# EAGLE design Stereo_Audio_Codec_Breakout_WM8960 (EAGLE 9.6.2)
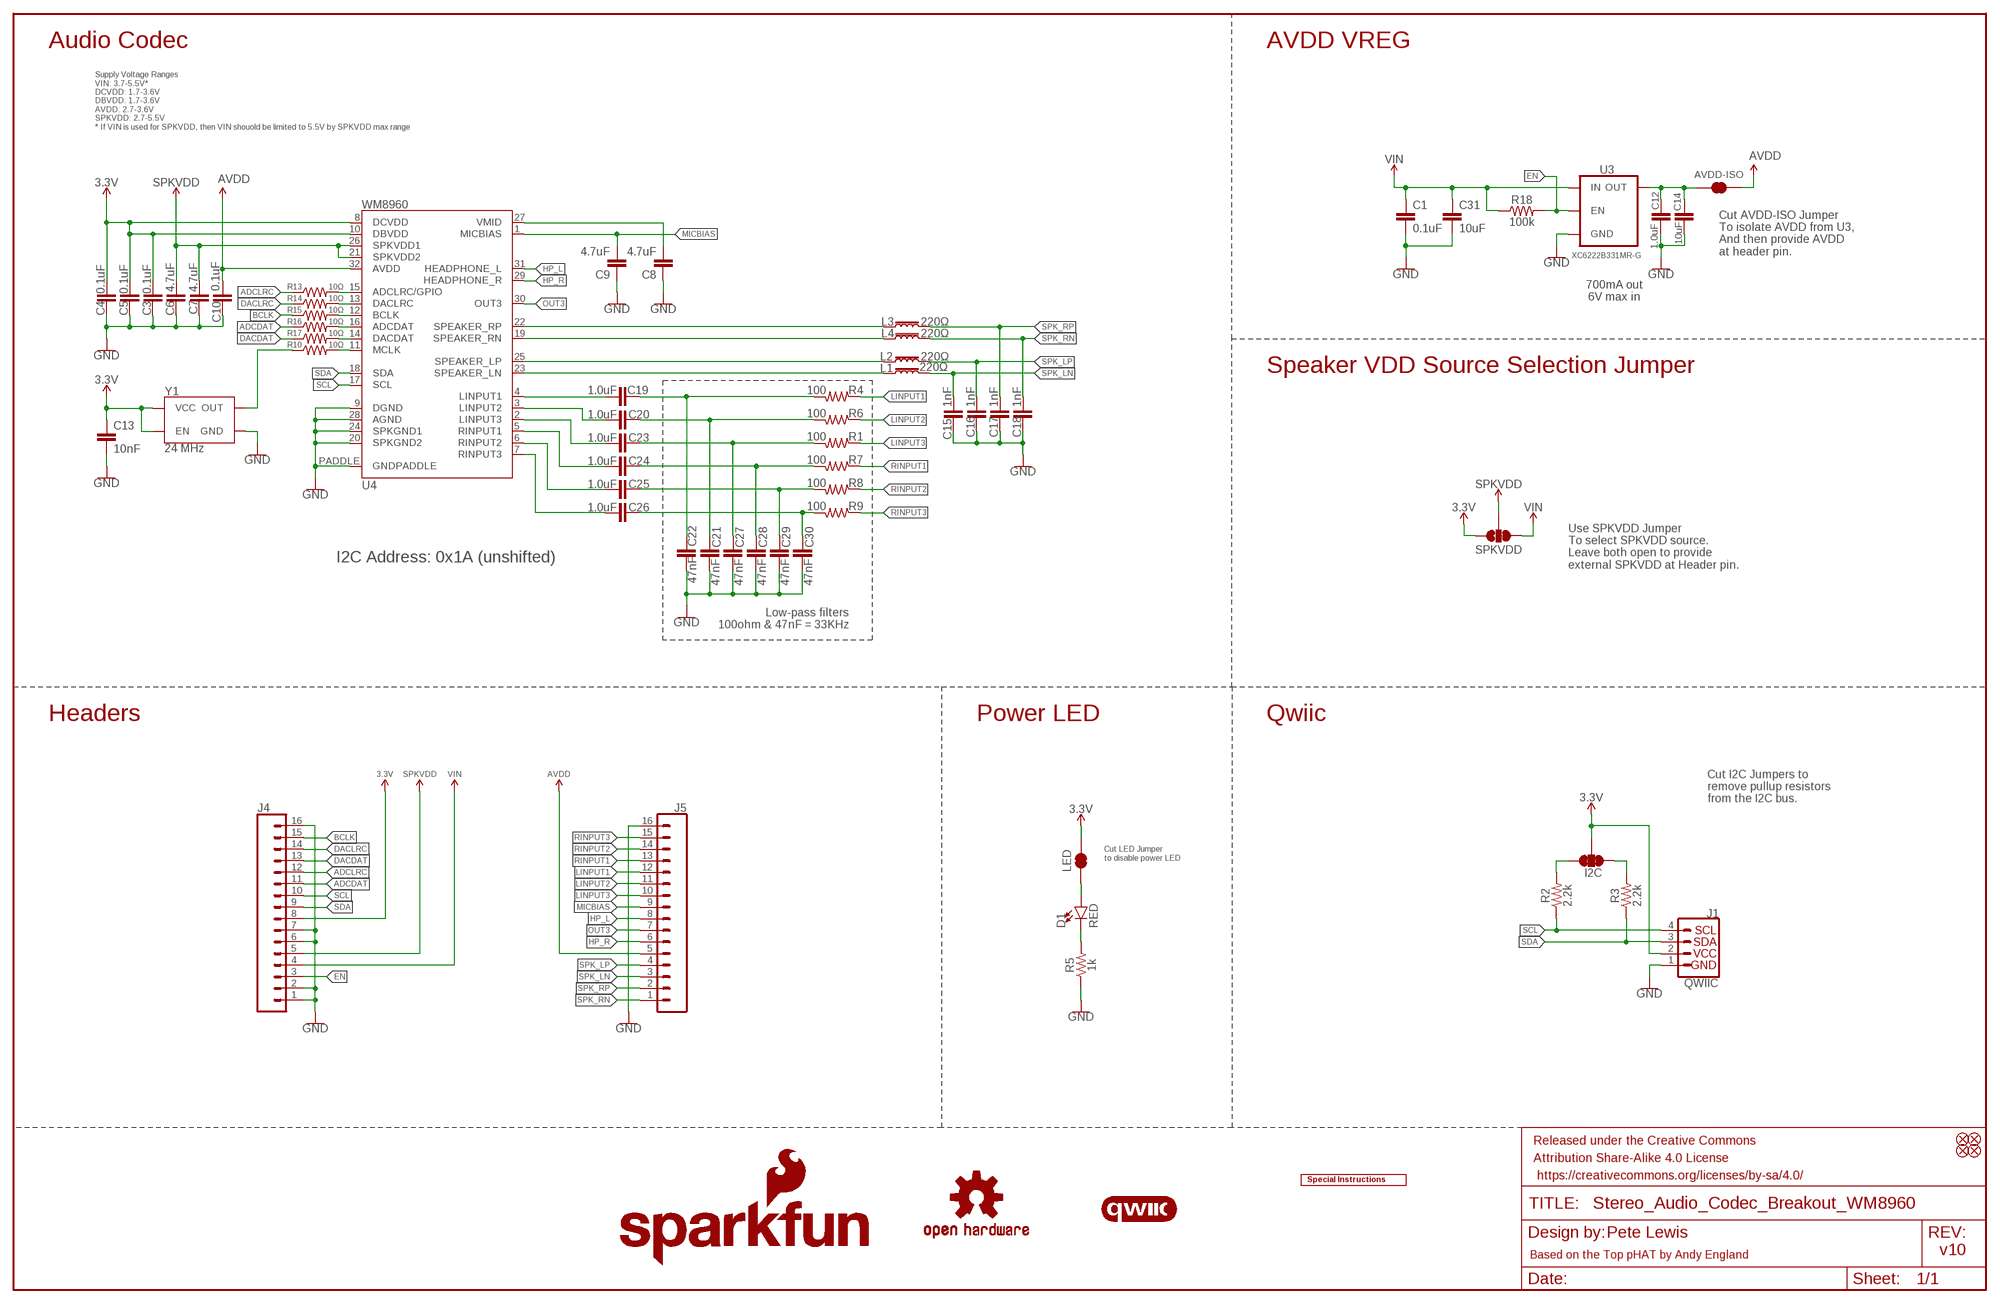
[diagram p0: schematic, sheet 1]

## Parts
AVDD-ISO  JUMPER-SMT_2_NC_TRACE_SILK  [SMT-JUMPER_2_NC_TRACE_SILK]
C1  0.1uF  0.1UF-0402T-16V-10%  [0402-TIGHT]
C3  0.1uF  0.1UF-0402T-16V-10%  [0402-TIGHT]
C4  0.1uF  0.1UF-0402T-16V-10%  [0402-TIGHT]
C5  0.1uF  0.1UF-0402T-16V-10%  [0402-TIGHT]
C6  4.7uF  4.7UF-0603-6.3V-(10%)  [0603]
C7  4.7uF  4.7UF-0603-6.3V-(10%)  [0603]
C8  4.7uF  4.7UF-0402_TIGHT-6.3V-20%-X5R  [0402-TIGHT]
C9  4.7uF  4.7UF-0402_TIGHT-6.3V-20%-X5R  [0402-TIGHT]
C10  0.1uF  0.1UF-0402T-16V-10%  [0402-TIGHT]
C12  1.0uF  1.0UF-0402T-16V-10%  [0402-TIGHT]
C13  10nF  10NF-0402T-25V-10%  [0402-TIGHT]
C14  10uF  10UF-0402T-6.3V-20%  [0402-TIGHT]
C15  1nF  1.0NF/1000PF-0402-25V-10%-X7R  [0402]
C16  1nF  1.0NF/1000PF-0402-25V-10%-X7R  [0402]
C17  1nF  1.0NF/1000PF-0402-25V-10%-X7R  [0402]
C18  1nF  1.0NF/1000PF-0402-25V-10%-X7R  [0402]
C19  1.0uF  1.0UF-0402T-16V-10%  [0402-TIGHT]
C20  1.0uF  1.0UF-0402T-16V-10%  [0402-TIGHT]
C21  47nF  47NF-0402_TIGHT-25V-10%-X7R  [0402-TIGHT]
C22  47nF  47NF-0402_TIGHT-25V-10%-X7R  [0402-TIGHT]
C23  1.0uF  1.0UF-0402T-16V-10%  [0402-TIGHT]
C24  1.0uF  1.0UF-0402T-16V-10%  [0402-TIGHT]
C25  1.0uF  1.0UF-0402T-16V-10%  [0402-TIGHT]
C26  1.0uF  1.0UF-0402T-16V-10%  [0402-TIGHT]
C27  47nF  47NF-0402_TIGHT-25V-10%-X7R  [0402-TIGHT]
C28  47nF  47NF-0402_TIGHT-25V-10%-X7R  [0402-TIGHT]
C29  47nF  47NF-0402_TIGHT-25V-10%-X7R  [0402-TIGHT]
C30  47nF  47NF-0402_TIGHT-25V-10%-X7R  [0402-TIGHT]
C31  10uF  10UF-0402T-6.3V-20%  [0402-TIGHT]
D1  RED  LED-RED0603  [LED-0603]
FD1  FIDUCIALUFIDUCIAL  [FIDUCIAL-MICRO]
FD2  FIDUCIALUFIDUCIAL  [FIDUCIAL-MICRO]
FD3  FIDUCIALUFIDUCIAL  [FIDUCIAL-MICRO]
FD4  FIDUCIALUFIDUCIAL  [FIDUCIAL-MICRO]
FRAME1  FRAME-LEDGER  [CREATIVE_COMMONS]
I2C  JUMPER-SMT_3_2-NC_TRACE_SILK  [SMT-JUMPER_3_2-NC_TRACE_SILK]
J1  QWIIC  QWIIC_CONNECTORJS-1MM  [JST04_1MM_RA]
J4  CONN_161X16_NO_SILK  [1X16_NO_SILK]
J5  CONN_161X16_NO_SILK  [1X16_NO_SILK]
L1  220Ω  FERRITE_BEAD-0805-220Ω-100MHZ-2A  [0805]
L2  220Ω  FERRITE_BEAD-0805-220Ω-100MHZ-2A  [0805]
L3  220Ω  FERRITE_BEAD-0805-220Ω-100MHZ-2A  [0805]
L4  220Ω  FERRITE_BEAD-0805-220Ω-100MHZ-2A  [0805]
LED  JUMPER-SMT_2_NC_TRACE_SILK  [SMT-JUMPER_2_NC_TRACE_SILK]
LOGO1  SFE_LOGO_NAME_FLAME.1_INCH  [SFE_LOGO_NAME_FLAME_.1]
LOGO3  QWIIC_LOGO_4MM  [QWIIC_4MM]
LOGO4  OSHW-LOGOS  [OSHW-LOGO-S]
LOGO5  SPECIAL_INSTRUCTIONS-ORDERING  [ORDERING_INSTRUCTIONS]
R1  100  100OHM-0402-TIGHT-1/16W-1%  [0402-TIGHT]
R2  2.2k  2.2KOHM-0402T-1/16W-1%  [0402-TIGHT]
R3  2.2k  2.2KOHM-0402T-1/16W-1%  [0402-TIGHT]
R4  100  100OHM-0402-TIGHT-1/16W-1%  [0402-TIGHT]
R5  1k  1KOHM-0402T-1/16W-1%  [0402-TIGHT]
R6  100  100OHM-0402-TIGHT-1/16W-1%  [0402-TIGHT]
R7  100  100OHM-0402-TIGHT-1/16W-1%  [0402-TIGHT]
R8  100  100OHM-0402-TIGHT-1/16W-1%  [0402-TIGHT]
R9  100  100OHM-0402-TIGHT-1/16W-1%  [0402-TIGHT]
R10  10Ω  10OHM-0402-1/16W-5%  [0402-TIGHT]
R13  10Ω  10OHM-0402-1/16W-5%  [0402-TIGHT]
R14  10Ω  10OHM-0402-1/16W-5%  [0402-TIGHT]
R15  10Ω  10OHM-0402-1/16W-5%  [0402-TIGHT]
R16  10Ω  10OHM-0402-1/16W-5%  [0402-TIGHT]
R17  10Ω  10OHM-0402-1/16W-5%  [0402-TIGHT]
R18  100k  100KOHM-0402T-1/16W-1%  [0402-TIGHT]
SPKVDD  JUMPER-SMT_3_1-NC_TRACE_SILK  [SMT-JUMPER_3_1-NC_TRACE_SILK]
U3  XC6222B331MR-G  [SOT23-5]
U4  WM8960  [QFN-32]
Y1  24 MHz  OSCILLATOR-24MHZ  [RESONATOR-SMD-3.2X2.5]

## Nets
3.3V: C3.2 C4.2 C5.2 C13.1 I2C.2 J1.2 J4.8 LED.2 SPKVDD.1 U4.8(DCVDD) U4.10(DBVDD) Y1.1(EN) Y1.4(VCC)
ADCDAT: J4.11 R16.1
ADCLRC: J4.12 R13.1
AVDD: AVDD-ISO.2 C10.2 J5.5 U4.32(AVDD)
AVDD-REG: AVDD-ISO.1 C12.1 C14.1 U3.5(OUT)
BCLK: J4.15 R15.1
DACDAT: J4.13 R17.1
DACLRC: J4.14 R14.1
EN: J4.3 R18.2 U3.3(EN)
GND: C1.2 C3.1 C4.1 C5.1 C6.2 C7.2 C8.1 C9.1 C10.1 C12.2 C13.2 C14.2 C15.2 C16.2 C17.2 C18.2 C21.2 C22.2 C27.2 C28.2 C29.2 C30.2 C31.2 J1.1 J4.1 J4.2 J4.6 J4.7 J4.16 J5.16 R5.1 U3.2(GND) U4.9(DGND) U4.20(SPKGND2) U4.24(SPKGND1) U4.28(AGND) U4.PADDLE(GNDPADDLE) Y1.2(GND)
HP_L: J5.8 U4.31(HEADPHONE_L)
HP_R: J5.6 U4.29(HEADPHONE_R)
LINPUT1: J5.12 R4.1
LINPUT2: J5.11 R6.1
LINPUT3: J5.10 R1.1
MICBIAS: C9.2 J5.9 U4.1(MICBIAS)
N$1: L3.1 U4.22(SPEAKER_RP)
N$2: R13.2 U4.15(ADCLRC/GPIO)
N$3: L4.1 U4.19(SPEAKER_RN)
N$4: L2.1 U4.25(SPEAKER_LP)
N$5: L1.1 U4.23(SPEAKER_LN)
N$6: D1.C R5.2
N$7: D1.A LED.1
N$8: C26.2 U4.7(RINPUT3)
N$9: C25.2 U4.6(RINPUT2)
N$10: C23.2 U4.2(LINPUT3)
N$11: R10.1 Y1.3(OUT)
N$12: C20.2 U4.3(LINPUT2)
N$13: C20.1 C21.1 R6.2
N$14: C19.1 C22.1 R4.2
N$15: C23.1 C27.1 R1.2
N$16: I2C.3 R2.2
N$17: I2C.1 R3.2
N$18: C24.1 C28.1 R7.2
N$19: C25.1 C29.1 R8.2
N$20: C26.1 C30.1 R9.2
N$21: R14.2 U4.13(DACLRC)
N$22: R15.2 U4.12(BCLK)
N$23: R16.2 U4.16(ADCDAT)
N$24: R17.2 U4.14(DACDAT)
N$25: R10.2 U4.11(MCLK)
N$29: C19.2 U4.4(LINPUT1)
N$30: C24.2 U4.5(RINPUT1)
N$38: C8.2 U4.27(VMID)
OUT3: J5.7 U4.30(OUT3)
RINPUT1: J5.13 R7.1
RINPUT2: J5.14 R8.1
RINPUT3: J5.15 R9.1
SCL: J1.4 J4.10 R2.1 U4.17(SCL)
SDA: J1.3 J4.9 R3.1 U4.18(SDA)
SPK_LN: C15.1 J5.3 L1.2
SPK_LP: C16.1 J5.4 L2.2
SPK_RN: C18.1 J5.1 L4.2
SPK_RP: C17.1 J5.2 L3.2
SPKVDD: C6.1 C7.1 J4.5 SPKVDD.2 U4.21(SPKVDD2) U4.26(SPKVDD1)
VIN: C1.1 C31.1 J4.4 R18.1 SPKVDD.3 U3.1(IN)

## Notes on the sheet
- Audio Codec | AVDD VREG
- Supply Voltage Ranges
  VIN: 3.7-5.5V*
  DCVDD: 1.7-3.6V
  DBVDD: 1.7-3.6V
  AVDD: 2.7-3.6V
  SPKVDD: 2.7-5.5V
  * If VIN is used for SPKVDD, then VIN shouold be limited to 5.5V by SPKVDD max range
- Cut AVDD-ISO Jumper
  To isolate AVDD from U3,
  And then provide AVDD
  at header pin.
- 700mA out
  6V max in
- Speaker VDD Source Selection Jumper
- Use SPKVDD Jumper
  To select SPKVDD source.
  Leave both open to provide
  external SPKVDD at Header pin.
- I2C Address: 0x1A (unshifted)
- Low-pass filters
  100ohm & 47nF = 33KHz
- Headers | Power LED | Qwiic
- Cut I2C Jumpers to 
  remove pullup resistors 
  from the I2C bus.
- Cut LED Jumper
  to disable power LED
- Pete Lewis
- v10
- Based on the Top pHAT by Andy England

## Library data of the parts
AVDD-ISO LED = SparkFun-Jumpers:JUMPER-SMT_2_NC_TRACE: Normally closed trace jumper This jumper has a trace between two pads so it's normally closed (NC). Use a razor knife to open the connection. For best results follow the IPC guidelines for cutting traces: Cutout at least 0.063 mm (0.005 in). Remove all loose material to clean up the cut area. Seal the cut with an approved epoxy. Reapply solder to reclose the connection.
C1 C3-C5 C10 = SparkFun-Capacitors:0.1UF: 0.1µF ceramic capacitors A capacitor is a passive two-terminal electrical component used to store electrical energy temporarily in an electric field.; PROD_ID: CAP-12416
C6 C7 = SparkFun-Capacitors:4.7UF: 4.7µF ceramic capacitors A capacitor is a passive two-terminal electrical component used to store electrical energy temporarily in an electric field.; PROD_ID: CAP-08280
C8 C9 = SparkFun-Capacitors:4.7UF: 4.7µF ceramic capacitors A capacitor is a passive two-terminal electrical component used to store electrical energy temporarily in an electric field.; PROD_ID: CAP-14240
C12 C19 C20 C23-C26 = SparkFun-Capacitors:1.0UF: 1µF ceramic capacitors A capacitor is a passive two-terminal electrical component used to store electrical energy temporarily in an electric field.; PROD_ID: CAP-12417
C13 = SparkFun-Capacitors:10NF: 0.01uF/10nF/10,000pF ceramic capacitors A capacitor is a passive two-terminal electrical component used to store electrical energy temporarily in an electric field. CAP-09321; PROD_ID: CAP-14847
C14 C31 = SparkFun-Capacitors:10UF: 10.0µF ceramic capacitors A capacitor is a passive two-terminal electrical component used to store electrical energy temporarily in an electric field.; PROD_ID: CAP-14848
C15-C18 = SparkFun-Capacitors:1.0NF/1000PF: 1nF/1,000pF ceramic capacitors A capacitor is a passive two-terminal electrical component used to store electrical energy temporarily in an electric field.; PROD_ID: CAP-15061
C21 C22 C27-C30 = SparkFun-Capacitors:47NF: 47nF ceramic capacitors A capacitor is a passive two-terminal electrical component used to store electrical energy temporarily in an electric field.; PROD_ID: CAP-14243
D1 = SparkFun-LED:LED-RED: Red SMD LED Used in manufacturing of most products at SparkFun Packages: 0603 - SMD 0603 package [Product Link] <http://docs.avagotech.com/docs/AV02-0551EN> 0603 SMART - SMD 0603 SMART package ( more efficient and expensive)[Product Link] <http://www.osram-os.com/Graphics/XPic2/00077099_0.pdf> 1206 - SMD1206 package [Product Link] <https://www.sparkfun.com/datasheets/DevTools/LilyPad/Q150OVS4.pdff> SparkFun Products: Pro Mini 328 -5V <https://www.sparkfun.com/products/821> RedBoard <https://www.sparkfun.com/products/12757> IOIO-OTG <https://www.sparkfun.com/products/13613>; PROD_ID: DIO-00819
FD1-FD4 = SparkFun-Aesthetics:FIDUCIAL: Fiducial Alignment Points Point-of-reference for pick-and-place machines and other optical instruments.
FRAME1 = SparkFun-Aesthetics:FRAME-LEDGER: Schematic Frame - Ledger Standard 11x14 US Ledger frame
I2C = SparkFun-Jumpers:JUMPER-SMT_3_2-NC_TRACE: Normally closed trace jumper (2 of 2 connections) This jumper has a trace between all three pads so they are normally closed (NC). Use a razor knife to open the connection(s). For best results follow the IPC guidelines for cutting traces: Cutout at least 0.063 mm (0.005 in). Remove all loose material to clean up the cut area. Seal the cut with an approved epoxy. Reapply solder to reclose the connection(s).
J1 = SparkFun-Connectors:QWIIC_CONNECTOR: SparkFun I2C Standard Qwiic Connector An SMD 1mm pitch JST connector makes it easy and quick (get it? Qwiic?) to connect I2C devices to each other. The Qwiic system <http://www.sparkfun.com/qwiic> enables fast and solderless connection between popular platforms and various sensors and actuators. We carry 200mm <https://www.sparkfun.com/products/14204>, 100mm <https://www.sparkfun.com/products/14205>, 50mm <https://www.sparkfun.com/products/14206>, and breadboard friendly <https://www.sparkfun.com/products/14207> Qwiic cables. We also offer 10 pcs strips <https://www.sparkfun.com/products/14323> the SMD connectors.; PROD_ID: CONN-13694; VALUE: QWIIC_RIGHT_ANGLE
J4 J5 = SparkFun-Connectors:CONN_16: Multi connection point. Often used as Generic Header-pin footprint for 0.1 inch spaced/style header connections On any of the 0.1 inch spaced packages, you can populate with these: Break Away Headers - Straight <https://www.sparkfun.com/products/116> (PRT-00116) Break Away Male Headers - Right Angle <https://www.sparkfun.com/products/553> (PRT-00553) Female Headers <https://www.sparkfun.com/products/115> (PRT-00115) Break Away Headers - Machine Pin <https://www.sparkfun.com/products/117> (PRT-00117) Break Away Female Headers - Swiss Machine Pin <https://www.sparkfun.com/products/743> (PRT-00743) For SCREWTERMINALS and SPRING TERMINALS visit here: Screw Terimnals on SparkFun.com <https://www.sparkfun.com/search/results?term=Screw+Terminals> (5mm/3.5mm/2.54mm spacing) This device is also useful as a general connection point to wire up your design to another part of your project. Our various solder wires solder well into these plated through hole pads. Hook-Up Wire - Assortment (Stranded, 22 AWG) <https://www.sparkfun.com/products/11375> (PRT-11375) Hook-Up Wire - Assortment (Solid Core, 22 AWG) <https://www.sparkfun.com/products/11367> (PRT-11367) View the entire wire category on our website here <https://www.sparkfun.com/categories/141> Special notes: Molex polarized connector foot print use with SKU : PRT-08231 with associated crimp pins and housings. 1MM SMD Version SKU: PRT-10208 NOTES ON THE VARIANTS LOCK and LOCK_LONGPADS... This footprint was designed to help hold the alignment of a through-hole component (i.e. 6-pin header) while soldering it into place. You may notice that each hole has been shifted either up or down by 0.005 of an inch from it's more standard position (which is a perfectly straight line). This slight alteration caused the pins (the squares in the middle) to touch the edges of the holes. Because they are alternating, it causes a "brace" to hold the component in place. 0.005 has proven to be the perfect amount of "off-center" position when using our standard breakaway headers. Although looks a little odd when you look at the bare footprint, once you have a header in there, the alteration is very hard to notice. Also,if you push a header all the way into place, it is covered up entirely on the bottom side.
L1-L4 = SparkFun-Coils:FERRITE_BEAD: Ferrite Bead (blocks, cores, rings, chokes, etc.) Inductor with layers of ferrite used to suppress high frequencies. Often used to isolate high frequency noise. SparkFun Products: IOIO-OTG - V2.2 <https://www.sparkfun.com/products/13613> SparkFun SAMD21 Mini Breakout <https://www.sparkfun.com/products/13664> SparkFun 6 Degrees of Freedom Breakout - LSM6DS3 <https://www.sparkfun.com/products/13339> SparkFun SAMD21 Dev Breakout <https://www.sparkfun.com/products/13672> Lilypad MP3 <https://www.sparkfun.com/products/11013>; PROD_ID: NDUC-10201
LOGO1 = SparkFun-Aesthetics:SFE_LOGO_NAME_FLAME: SparkFun Font Logo w/ Flame This is the SparkFun full logo. The logo on the schematic will always be the same size; the package variant is the height of the flame part of the logo. Default layer for the logo on the board is tSilk.
LOGO3 = SparkFun-Aesthetics:QWIIC_LOGO: Qwiic Logos for placement on schematic and PCB. The 5.5mm silk logo is best for placing next to Qwiic connector.
LOGO4 = SparkFun-Aesthetics:OSHW-LOGO: Open-Source Hardware (OSHW) Logo This logo indicates the piece of hardware it is found on incorporates a OSHW license and/or adheres to the definition of open source hardware found here: http://freedomdefined.org/OSHW
LOGO5 = SparkFun-Aesthetics:SPECIAL_INSTRUCTIONS: Special Ordering/Production Instructions Alert Symbol for special PCB ordering instructions or unique production process warnings. Ordering Instructions Production Instructions Types of information that should be added to box: Copper weight Soldermask color Silk color PCB thickness Number of layers PCB Standard: 1.6mm FR4 1 oz copper immersion silver plating red soldermask white silkscreen Types of information that should be added to box: Special wash requirements Depaneling instructions Humidification Glue curing Default text settings: 0.07 inch 9% ratio 50% line distance
R1 R4 R6-R9 = SparkFun-Resistors:100OHM: 100Ω resistor A resistor is a passive two-terminal electrical component that implements electrical resistance as a circuit element. Resistors act to reduce current flow, and, at the same time, act to lower voltage levels within circuits. - Wikipedia; PROD_ID: RES-14962
R2 R3 = SparkFun-Resistors:2.2KOHM: 2.2kΩ resistor A resistor is a passive two-terminal electrical component that implements electrical resistance as a circuit element. Resistors act to reduce current flow, and, at the same time, act to lower voltage levels within circuits. - Wikipedia; PROD_ID: RES-14341
R5 = SparkFun-Resistors:1KOHM: 1kΩ resistor A resistor is a passive two-terminal electrical component that implements electrical resistance as a circuit element. Resistors act to reduce current flow, and, at the same time, act to lower voltage levels within circuits. - Wikipedia; PROD_ID: RES-14342
R10 R13-R17 = SparkFun-Resistors:10OHM: 10Ω resistor A resistor is a passive two-terminal electrical component that implements electrical resistance as a circuit element. Resistors act to reduce current flow, and, at the same time, act to lower voltage levels within circuits. - Wikipedia; PROD_ID: RES-16072
R18 = SparkFun-Resistors:100KOHM: 100kΩ resistor A resistor is a passive two-terminal electrical component that implements electrical resistance as a circuit element. Resistors act to reduce current flow, and, at the same time, act to lower voltage levels within circuits. - Wikipedia; PROD_ID: RES-13495
SPKVDD = SparkFun-Jumpers:JUMPER-SMT_3_1-NC_TRACE: Normally closed trace jumper (1 of 2 connections) This jumper has a trace between two pads so it's normally closed (NC). The other connection is normally open (NO). Use a razor knife to open the connection. For best results follow the IPC guidelines for cutting traces: Cutout at least 0.063 mm (0.005 in). Remove all loose material to clean up the cut area. Seal the cut with an approved epoxy. Reapply solder to reclose the connection, or to close the NO connection.
U3 = SparkFun-IC-Power:XC6222; IOUT: 700mA; PROD_ID: VREG-16775; VOUT: 3.3V
U4 = SparkFun-IC-Special-Function:WM8960: Cirrus Logic WM890 - Stereo Audio CODEC I2S enabled audio CODEC with stereo microphone input ADC's and stereo audio output DAC's. Onboard 1W Class D Speaker driver is also capable of driving an 8 Ohm speaker. Also has an onboard headphone driver.; PROD_ID: IC-14824
Y1 = SparkFun-Clocks:OSCILLATOR-24MHZ: Abracon 24 MHZ Oscillator 3.3V - 50 PPM - 15 pF - 24 MHz Oscillator; PROD_ID: XTAL-14907

## Board
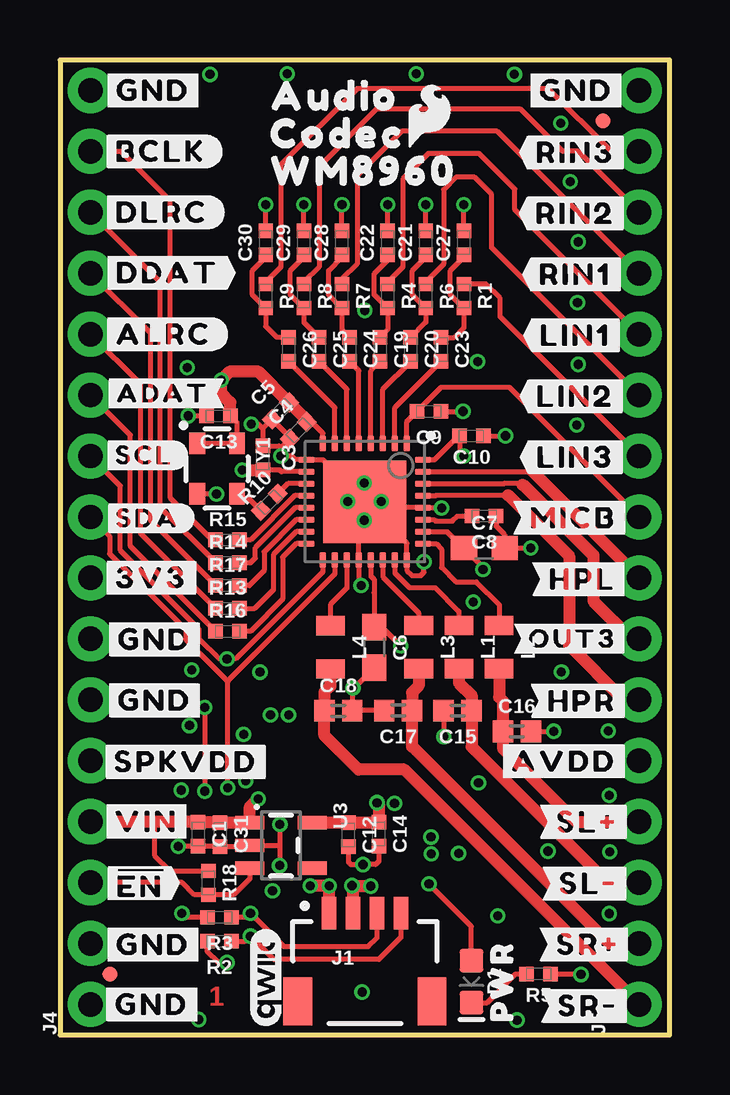
[diagram p1: board, top side]
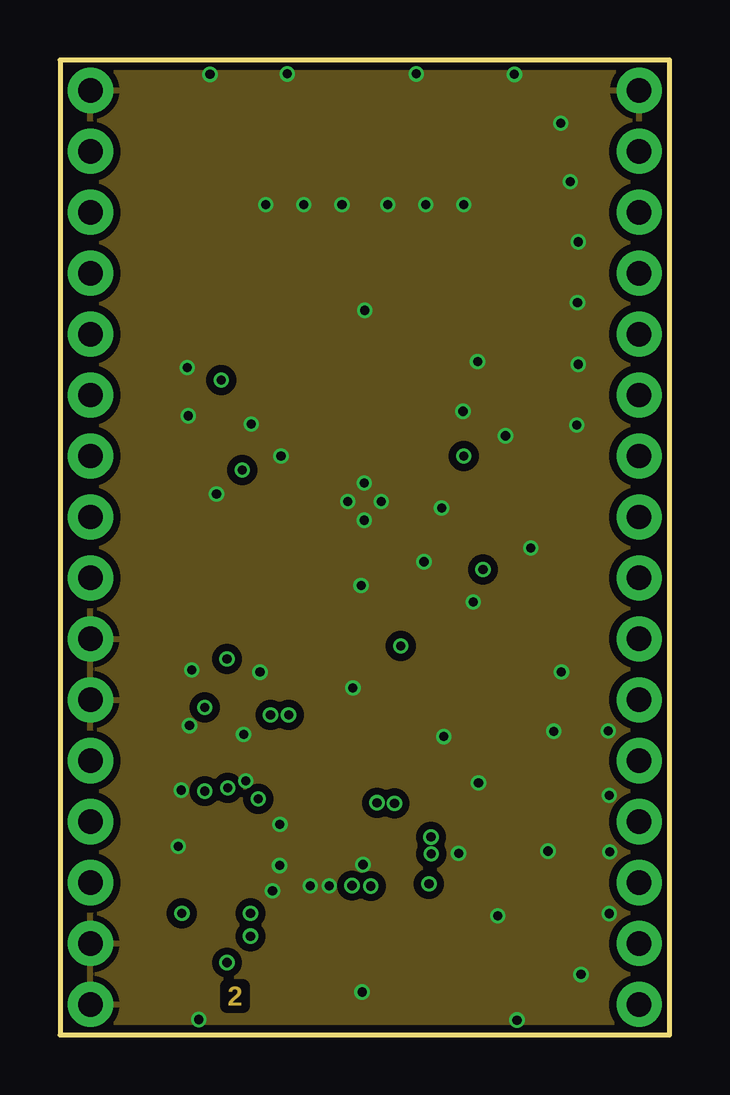
[diagram p2: board, inner layer Route2]
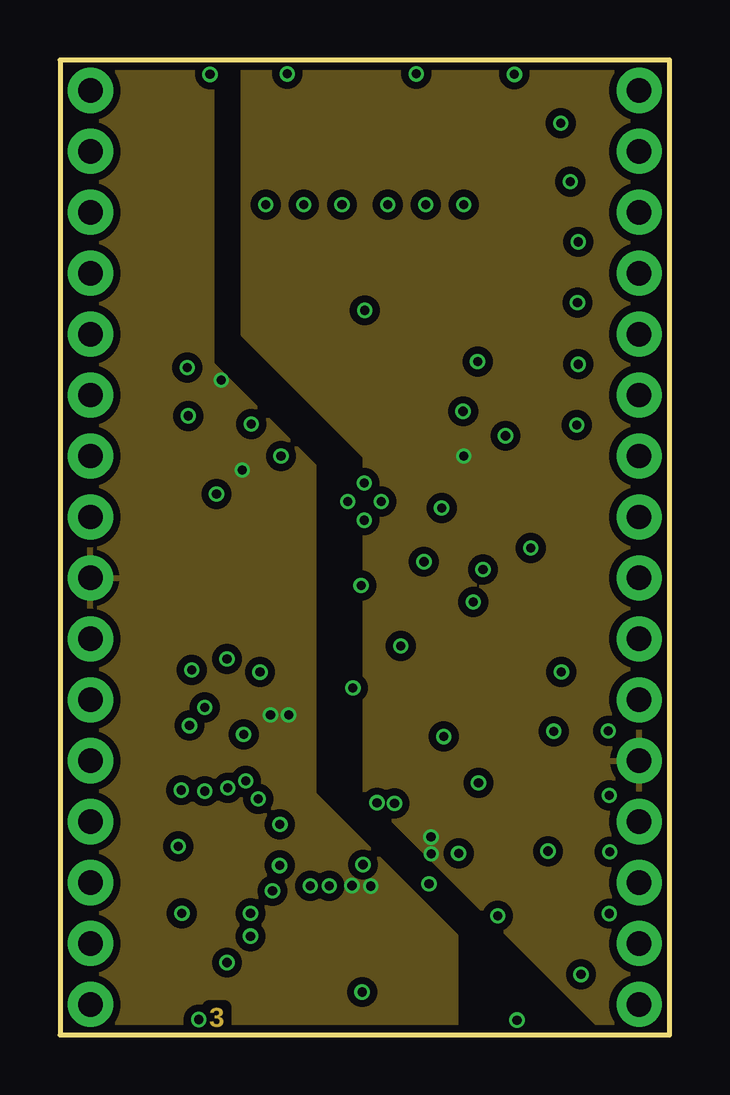
[diagram p3: board, inner layer Route15]
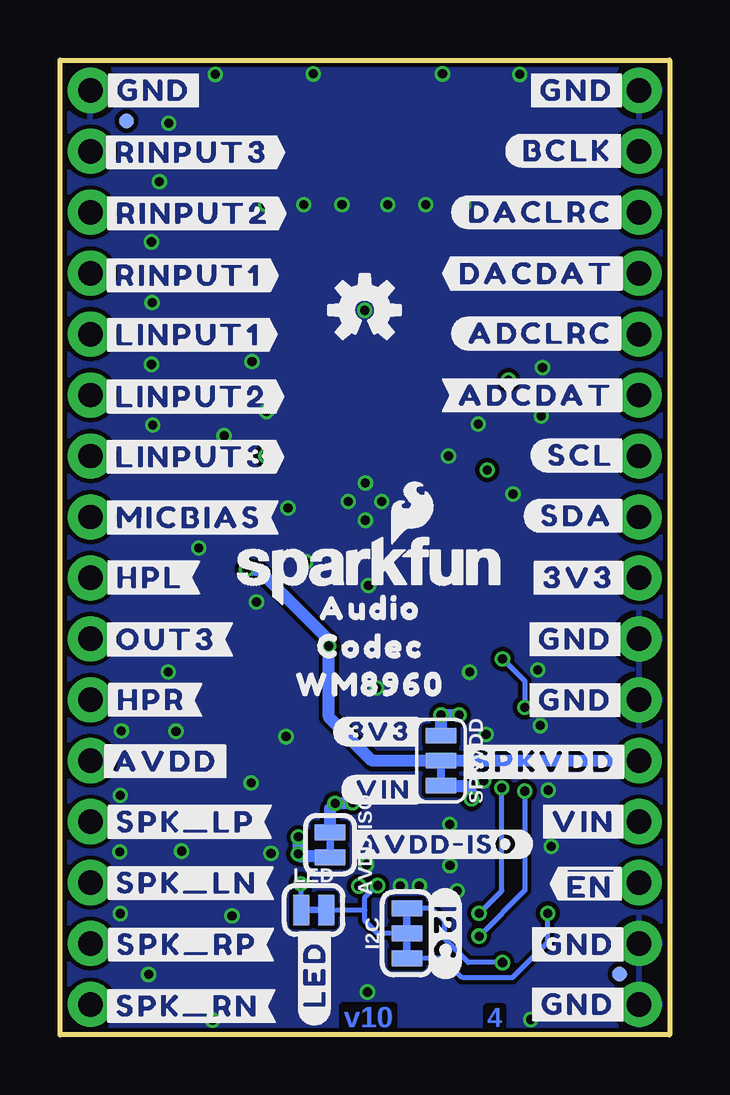
[diagram p4: board, bottom side, seen from below]

Size 25.4 x 40.64 mm. Coordinates in mm from the lower left corner, seen from the top.
Outline: 0,0 25.4,0 25.4,40.64 0,40.64 0,0
Copper layers (1*2*15*16): Top 0.035559375mm / dielectric 0.47751875mm / Route2 0.035559375mm / dielectric 0.47751875mm / Route15 0.035559375mm / dielectric 0.47751875mm / Bottom 0.035559375mm
Design rules "SparkFun-4-Layer-Minimum-JLCPCB": minimum track width 5mil, minimum drill 0.2mm, track to track 5mil, track to pad 5mil, pad to pad 5mil, via to via 5mil, smd to smd 5mil, copper to edge 7mil, drill to drill 7mil, minimum pad ring 5mil, minimum via ring 5mil, stop-mask expansion 2.5mil, vias tented up to drill 25mil, thermal gap 10mil
tRestrict: area 14.6,22.2 to 14.6,22.4; area 12.5,24.1 to 12.9,24.2; area 10.7,22.1 to 10.8,22.4; area 12.7,20.3 to 13,20.4

### Footprints (pad centres in the part's own frame; a part is rotated, then mirrored left to right if it is on the bottom)
SMT-JUMPER_2_NC_TRACE_SILK = smd 0.66 x 1.27: 1 -0.521,0; 2 0.521,0
0402-TIGHT = smd 0.6 x 0.6: 1 -0.5,0; 2 0.5,0
0603 = smd 1.1 x 1: 1 -0.85,0; 2 0.85,0
0402 = smd 0.85 x 0.9: 1 -0.58,0; 2 0.58,0
LED-0603 = smd 1 x 1: A -0.877,0; C 0.877,0
FIDUCIAL-MICRO = smd 0.635 x 0.635: 1 0,0
SMT-JUMPER_3_2-NC_TRACE_SILK = smd 0.66 x 1.27: 1 -1.041,0; 2 0,0; 3 1.041,0
JST04_1MM_RA = smd 0.6 x 1.35: 1 -1.5,0; 2 -0.5,0; 3 0.5,0; 4 1.5,0 | smd 1.2 x 2: NC1 2.8,-3.675; NC2 -2.8,-3.675
1X16_NO_SILK = drill 1.016 pad 1.88: 1 0,0; 2 2.54,0; 3 5.08,0; 4 7.62,0; 5 10.16,0; 6 12.7,0; 7 15.24,0; 8 17.78,0; 9 20.32,0; 10 22.86,0; 11 25.4,0; 12 27.94,0; 13 30.48,0; 14 33.02,0; 15 35.56,0; 16 38.1,0
0805 = smd 0.8 x 1.2: 1 -0.9,0; 2 0.9,0
SMT-JUMPER_3_1-NC_TRACE_SILK = smd 0.66 x 1.27: 1 -1.041,0; 2 0,0; 3 1.041,0
SOT23-5 = smd 0.55 x 1.2: 1 -0.95,-1.3; 2 0,-1.3; 3 0.95,-1.3; 4 0.95,1.3; 5 -0.95,1.3
QFN-32 = smd 0.654 x 0.25: 1 -2.427,1.75; 2 -2.427,1.25; 3 -2.427,0.75; 4 -2.427,0.25; 5 -2.427,-0.25; 6 -2.427,-0.75; 7 -2.427,-1.25; 8 -2.427,-1.75; 17 2.427,-1.75; 18 2.427,-1.25; 19 2.427,-0.75; 20 2.427,-0.25; 21 2.427,0.25; 22 2.427,0.75; 23 2.427,1.25; 24 2.427,1.75 | smd 0.25 x 0.654: 9 -1.75,-2.427; 10 -1.25,-2.427; 11 -0.75,-2.427; 12 -0.25,-2.427; 13 0.25,-2.427; 14 0.75,-2.427; 15 1.25,-2.427; 16 1.75,-2.427; 25 1.75,2.427; 26 1.25,2.427; 27 0.75,2.427; 28 0.25,2.427; 29 -0.25,2.427; 30 -0.75,2.427; 31 -1.25,2.427; 32 -1.75,2.427 | smd 3.45 x 3.45: PADDLE 0,0
RESONATOR-SMD-3.2X2.5 = smd 0.9 x 0.65: 1 -1.05,-0.825; 2 1.05,-0.825; 3 1.05,0.825; 4 -1.05,0.825

### Placement (x,y rotation side)
AVDD-ISO  14.15,7.93 270 bottom
C1  5.75,8.37 270 top
C3  8.45,24.06 270 top
C4  9.93,25.2 45 top
C5  9.19,26.01 45 top
C6  13.09,16.15 270 top
C7  17.68,20.29 0 top
C8  17.67,21.63 180 top
C9  15.37,25.99 180 top
C10  17.14,24.97 180 top
C12  12.01,8.34 270 top
C13  6.6,25.8 180 top
C14  13.28,8.37 270 top
C15  16.57,13.52 180 top
C16  19.04,12.65 0 top
C17  14.09,13.52 180 top
C18  11.6,13.51 0 top
C19  13.34,28.57 270 top
C20  14.61,28.57 270 top
C21  15.24,33.02 90 top
C22  13.65,33.02 90 top
C23  15.88,28.57 270 top
C24  12.06,28.57 270 top
C25  10.79,28.57 270 top
C26  9.53,28.57 270 top
C27  16.83,33.02 90 top
C28  11.75,33.02 90 top
C29  10.16,33.02 90 top
C30  8.57,33.02 90 top
C31  6.67,8.36 270 top
D1  17.14,2.22 270 top
FD1  2.08,2.54 0 top
FD2  2.08,2.54 0 bottom
FD3  22.62,38.1 180 top
FD4  22.62,38.1 180 bottom
FRAME1  -13.97,-27.3 0 top  (outside the outline)
I2C  10.95,4.23 90 bottom
J1  12.7,5.08 0 top
J4  1.27,1.27 90 top
J5  24.13,1.27 90 top
L1  16.62,16.16 270 top
L2  18.29,16.16 270 top
L3  14.95,16.16 270 top
L4  11.27,16.15 270 top
LED  14.83,5.21 0 bottom
LOGO1  12.46,19.37 0 bottom
LOGO3  8.59,2.4 90 top
LOGO4  12.7,30.21 0 bottom
LOGO5  50.8,43.18 0 top  (outside the outline)
R1  16.83,30.8 270 top
R2  6.64,3.9 180 top
R3  6.65,4.9 180 top
R4  13.65,30.8 270 top
R5  19.94,2.54 180 top
R6  15.24,30.8 270 top
R7  11.75,30.8 270 top
R8  10.16,30.8 270 top
R9  8.57,30.8 270 top
R10  8.72,22.21 45 top
R13  6.99,17.78 0 top
R14  6.99,19.68 0 top
R15  6.99,20.64 0 top
R16  6.99,16.83 0 top
R17  6.99,18.73 0 top
R18  6.18,6.34 270 top
SPKVDD  9.53,11.43 270 bottom
U3  9.21,7.9 270 top
U4  12.7,22.23 270 top
U$1  [AUDIO8960896055]  12.46,17.78 0 bottom
U$2  [CODEC8960896056]  12.46,16.19 0 bottom
U$3  [CODEC8960896057]  11.56,37.56 0 top
U$4  [#GND#8]  3.83,3.77 0 bottom
U$5  [#BCLK#0]  4.19,36.83 0 top
U$7  [#GND#8]  3.87,3.76 0 top
U$8  [#GND#8]  3.82,1.27 0 top
U$9  [#GND#8]  3.82,1.27 0 bottom
U$10  [#AVDD#22]  21.01,11.4 0 bottom
U$11  [#GND#8]  3.87,39.37 0 bottom
U$12  [#GND#8]  21.5,39.37 0 bottom
U$13  [#SR##4]  22,3.77 0 top
U$14  [#SL##6]  22.02,6.31 0 top
U$15  [#SR##5]  22,1.21 0 top
U$16  [#SL##7]  21.97,8.88 0 top
U$17  [#GND#8]  3.94,13.95 0 bottom
U$18  [#GND#8]  3.94,16.48 0 top
U$19  [#GND#8]  3.94,13.94 0 top
U$20  [#AVDD#ISO#0]  9.6,7.94 0 bottom
U$21  [#3V3#0]  12.09,12.64 0 bottom
U$22  [#VIN#0]  11.92,10.23 0 bottom
U$23  [#ALRC#0]  4.32,29.21 0 top
U$24  [#DLRC#1]  4.24,34.29 0 top
U$26  [#HPL#10]  21.77,19 0 top
U$27  [#HPR#11]  21.74,13.92 0 top
U$28  [#3V3#12]  3.81,19.05 0 top
U$29  [SFE_LOGO_FLAME_.1]  14.24,36.67 0 top
U$30  [#SPKVDD#51]  5.24,11.38 0 top
U$31  [#GND#8]  3.87,39.37 0 top
U$32  [#GND#8]  21.5,39.37 0 top
U$34  [##EN##1]  3.33,6.32 0 top
U$35  [PWR12]  18.41,2.22 90 top
U$36  [WM8960896054]  12.46,14.61 0 bottom
U$37  [#OUT3#0]  20.98,16.48 0 bottom
U$38  [##EN##2]  3.33,6.3 0 bottom
U$39  [#LED#17]  14.8,2.52 90 bottom
U$40  [#I2C#18]  9.35,4.22 270 bottom
U$41  [#OUT3#4]  21.36,16.51 0 top
U$44  [#RINPUT1#0]  20.04,31.66 0 bottom
U$45  [#VIN#19]  3.6,8.9 0 top
U$46  [#VIN#19]  3.6,8.89 0 bottom
U$47  [#RINPUT2#0]  19.86,34.24 0 bottom
U$48  [#AVDD#22]  21,11.4 0 top
U$49  [#RINPUT3#0]  19.91,36.78 0 bottom
U$50  [#GND#8]  3.94,16.49 0 bottom
U$51  [#3V3#12]  3.79,19.05 0 bottom
U$52  [#ADCLRC#2]  5.38,29.24 0 bottom
U$54  [#RIN3#0]  21.48,36.78 0 top
U$55  [#DACLRC#4]  5.38,34.29 0 bottom
U$56  [#RIN2#0]  21.48,34.24 0 top
U$57  [#BCLK#5]  4.27,36.86 0 bottom
U$58  [#ADCDAT#6]  5.57,26.66 0 bottom
U$59  [#MICB#31]  21.38,21.55 0 top
U$60  [WM89600]  12.67,36.01 0 top
U$61  [AUDIO0]  11.47,39.13 0 top
U$62  [#LINPUT1#0]  20.05,29.18 0 bottom
U$63  [#LINPUT2#0]  19.92,26.61 0 bottom
U$64  [#SPKVDD#51]  5.22,11.38 0 bottom
U$65  [#LINPUT3#0]  19.92,24.09 0 bottom
U$66  [#SCL#0]  3.51,24.16 0 top
U$67  [#SDA#0]  3.66,21.54 0 top
U$68  [#RIN1#0]  21.48,31.7 0 top
U$69  [#DDAT#9]  4.48,31.77 0 top
U$70  [#DACDAT#8]  5.55,31.73 0 bottom
U$71  [#ADAT#10]  4.29,26.74 0 top
U$74  [#SCL#40]  3.71,24.15 0 bottom
U$75  [#SDA#41]  3.86,21.64 0 bottom
U$76  [#LIN1#0]  21.48,29.16 0 top
U$77  [#LIN2#0]  21.48,26.62 0 top
U$78  [#LIN3#0]  21.48,24.08 0 top
U$79  [#MICBIAS#42]  20.02,21.57 0 bottom
U$80  [#HPL#43]  21.65,19.07 0 bottom
U$82  [#HPR#45]  21.59,13.97 0 bottom
U$83  [#SPK_LP#46]  20.16,8.88 0 bottom
U$84  [#SPK_LN#47]  20.11,6.33 0 bottom
U$85  [#SPK_RP#48]  20.1,3.76 0 bottom
U$86  [#SPK_RN#49]  20.09,1.2 0 bottom
Y1  6.54,23.61 270 top

### Tracks (layer width: path | path; a pad name or v marks a point on that pad's centre or on a via)
3.3V  (via drill 0.38)
  Top 0.203: U4.10 9.23,23.48 9.15,23.56 C3.2 | C13.1 7.37,25.54 Y1.4 Y1.1 | U4.8 10.95,25.09 10.41,25.63 10.28,25.63
  Top 0.508: C13.1 7.1,26.36 6.72,26.75 v6.72,27.3 7.06,27.64 8.27,27.64 C5.2 10.28,25.63 C4.2 | v7.59,23.55 7.61,23.56 C3.2 | J1.2 12.2,6.19 v12.17,6.22 12.92,6.22 v12.95,6.2
  Bottom 0.203: I2C.2 12.18,4.23 12.7,4.75 12.7,5.21 | 12.7,5.21 12.7,5.74 12.22,6.22 v12.17,6.22 | LED.2 12.7,5.21
  Bottom 0.508: SPKVDD.1 v9.53,13.34 v8.78,13.34 v8.77,13.34
  pour Route15 (isolate 0.305): 6.35,40.64 0,40.64 0,0 16.51,0 16.51,4.11 10.6,10.02 10.6,23.69 6.35,27.94
ADCDAT
  Top 0.203: R16.1 2.93,20.38 2.93,25.01 J4.11
ADCLRC
  Top 0.203: R13.1 3.35,20.91 3.35,27.12 J4.12
AVDD  (via drill 0.38)
  Top 0.203: U4.32 15.61,23.98 16.6,24.97 C10.2 16.65,24.31 v16.83,24.13
  Bottom 0.508: AVDD-ISO.2 14.17,7.43 15.35,7.43 v15.47,7.55 v15.46,7.56 v15.46,8.25
  pour Route15 (isolate 0.305): 25.4,40.64 7.62,40.64 7.62,29.21 12.7,24.13 12.7,10.16 22.86,0 25.4,0
AVDD-REG  (via drill 0.38)
  Top 0.508: U3.5 C12.1 13.26,8.84 C14.1 13.28,9.6 v13.21,9.68
  Bottom 0.508: AVDD-ISO.1 14.15,9.44 v13.94,9.65 13.91,9.68 v13.21,9.68
BCLK
  Top 0.203: J4.15 2.54,36.83 4.58,34.79 4.58,22.41 6.35,20.64 R15.1
DACDAT
  Top 0.203: R17.1 3.77,21.44 3.77,29.25 J4.13
DACLRC
  Top 0.203: R14.1 4.18,21.99 4.18,31.38 J4.14
EN
  Top 0.203: U3.3 7.91,6.51 7.24,5.84 R18.2 5.6,5.84 5.09,6.35 J4.3
GND  (via drill 0.38)
  Top 0.203: C8.1 18.17,21.21 18.53,20.85 C7.2 v19.62,20.29 | 12.45,20.7 U4.20 12.45,18.82 v12.54,18.73 | 14.2,20.75 14.45,20.5 U4.24 14.45,19.36 14.67,19.14 15.03,19.14 15.16,19.28 v15.16,19.72 | 14.2,22.02 14.24,21.98 U4.28 15.88,21.98 v15.9,21.96 | 11.15,23.77 10.95,23.98 U4.9 9.8,23.98 9.65,24.12 v9.21,24.12 9.21,24.48 | R5.1 21.69,2.54 v21.71,2.52 | C30.2 v8.57,34.61 | C29.2 v10.16,34.61 | C28.2 v11.75,34.61 | C22.2 v13.65,34.61 | C21.2 v15.24,34.61 | C27.2 v16.83,34.61 | 9.21,24.48 C4.1 9.57,24.92 C5.1 8.45,25.27 | 9.21,24.48 9.13,24.56 C3.1 8.45,25.27 | v7.97,25.47 8.26,25.47 8.45,25.27 | C13.2 v5.35,25.8 v5.34,25.8 | C9.1 v16.79,25.99 | C10.1 v18.56,24.97 | Y1.2 v6.51,22.56 v6.52,22.55 | C16.2 v20.57,12.66 | C15.2 v15.99,12.44 v15.98,12.44 | C17.2 C18.2 12.21,13.54 v12.21,14.47 12.26,14.47 C6.2 | U4.PADDLE 12,22.23 v11.99,22.24 | C14.2 13.28,7.24 13.15,7.1 v12.63,7.1 12.12,7.1 12.01,7.21 C12.2 | v4.93,7.86 C1.2 6.66,7.87 C31.2 7.87,7.86 U3.2 9.16,7.9 | v9.16,8.77 9.16,7.9 | 9.16,7.9 9.16,7.07 v9.15,7.06
  Top 0.508: J1.1 11.22,5.1 v11.22,6.21 10.43,6.21 v10.42,6.22
  other vias: 20.89,15.13 12.7,30.2 17.4,28.07 13.39,22.24 12.67,23 12.67,21.45 8.85,6.01 18.93,40.04 14.85,40.06 9.46,40.06 6.25,40.04 5.79,0.64 19.04,0.61 12.59,1.79 5.06,10.2 7.74,10.59 5.39,12.89 5.49,15.21 8.33,15.12 7.65,12.52 5.3,27.82 17.21,18.05 22.89,9.98 21.53,25.42 21.59,27.96 21.56,30.52 21.59,33.06 21.26,35.57 20.87,38.01 22.84,12.67 22.91,7.63 22.89,5.06 20.33,7.66 18.23,4.97 17.44,10.51 16.61,7.57
  pour Bottom (isolate 0.178): 0,0 0,40.64 25.4,40.64 25.4,0
  pour Route2 (isolate 0.305): 0,0 0,40.64 25.4,40.64 25.4,0
HP_L
  Top 0.203: U4.31 19.7,23.48
  Top 0.508: 19.7,23.48 J5.8
HP_R
  Top 0.203: U4.29 15.64,22.48 15.67,22.5 18.67,22.5 | 23.47,13.97 J5.6
  Top 0.508: 23.47,13.97 21.21,16.23 21.21,19.96 18.67,22.5
LINPUT1
  Top 0.203: J5.12 18.95,34.39 18.95,35.26 17.46,36.74 15.34,36.74 14.29,35.69 14.29,32.01 13.65,31.37 R4.1
LINPUT2
  Top 0.203: J5.11 17.98,32.82 17.98,35.04 17.27,35.75 16.5,35.75 15.99,35.24 15.99,32.12 15.24,31.37 R6.1
LINPUT3
  Top 0.203: J5.10 24.13,24.14 18.34,29.93 18.34,30.71 17.75,31.3 R1.1
MICBIAS
  Top 0.203: J5.9 18.73,26.99 15.87,26.99 C9.2 14.45,25.57 U4.1
N$1
  Top 0.203: U4.22 13.45,19.09 14.95,17.6 L3.1
N$2
  Top 0.203: U4.15 9.85,20.98 8.89,20.02 8.89,18.55 8.12,17.78 R13.2
N$3
  Top 0.203: U4.19 11.95,18.62 11.27,17.94 L4.1
N$4
  Top 0.203: U4.25 15.67,20.48 15.9,20.24 15.9,19.48 16.49,18.89 17.35,18.89 18.29,17.95 L2.1 | L2.1
N$5
  Top 0.203: U4.23 13.95,19.25 14.55,18.64 15.63,18.64 16.62,17.65 L1.1
N$6
  Top 0.203: D1.C 17.79,1.34 18.99,2.54 R5.2
N$7  (via drill 0.38)
  Top 0.203: D1.A 17.14,4.52 v15.37,6.29
  Bottom 0.203: v15.37,6.29 15.37,5.23 LED.1
N$8
  Top 0.203: U4.7 11.45,26.15 C26.2
N$9
  Top 0.203: U4.6 11.95,26.92 C25.2
N$10
  Top 0.203: U4.2 13.95,26.16 C23.2
N$11
  Top 0.203: Y1.3 7.57,22.36 7.86,22.36 R10.1
N$12
  Top 0.203: U4.3 13.45,26.92 C20.2
N$13
  Top 0.203: C20.1 15.24,29.71 R6.2 14.68,30.86 14.68,31.86 15.24,32.42 C21.1
N$14
  Top 0.203: C19.1 13.65,29.39 R4.2 13.09,30.86 13.09,31.73 13.65,32.29 C22.1
N$15
  Top 0.203: C23.1 16.42,29.07 16.83,29.48 R1.2 16.27,30.86 16.27,31.86 16.83,32.42 C27.1
N$16  (via drill 0.38)
  Top 0.203: v6.96,3.02 6.58,3.02 6.14,3.46 R2.2
  Bottom 0.203: v6.96,3.02 8.39,3.02 9.37,4 9.37,4.72 9.92,5.27 I2C.3
N$17  (via drill 0.38)
  Top 0.203: R3.2 5.25,4.9 v5.08,5.07
  Bottom 0.203: v5.08,5.07 5.08,3.86 6.55,2.39 8.64,2.39 9.44,3.19 I2C.1
N$18
  Top 0.203: C24.1 11.75,29.39 R7.2 11.19,30.86 11.19,31.86 11.75,32.42 C28.1
N$19
  Top 0.203: C25.1 10.16,29.71 R8.2 9.6,30.86 9.6,31.86 10.16,32.42 C29.1
N$20
  Top 0.203: C26.1 9.04,29.07 8.57,29.55 R9.2 8.01,30.86 8.01,31.86 8.57,32.42 C30.1
N$21
  Top 0.203: U4.13 9.8,21.98 8.14,20.32 8.14,19.88 7.95,19.68 R14.2
N$22
  Top 0.203: U4.12 9.78,22.48 7.94,20.64 R15.2
N$23
  Top 0.203: R16.2 7.94,16.83 9.27,18.16 9.27,19.91 9.84,20.48 U4.16
N$24
  Top 0.203: U4.14 9.85,21.48 8.51,20.14 8.51,19.36 7.89,18.73 R17.2
N$25
  Top 0.203: U4.11 9.49,22.98 R10.2
N$29
  Top 0.203: U4.4 12.95,27.68 C19.2
N$30
  Top 0.203: U4.5 12.45,27.69 C24.2
N$38
  Top 0.203: U4.27 15.58,21.48 15.65,21.41 16.35,21.41 16.57,21.63 C8.2
OUT3
  Top 0.203: U4.30 18.5,22.98 18.53,23 19.21,23 19.28,22.94 | 23.81,16.51 J5.7
  Top 0.508: 23.81,16.51 22.23,18.1 22.23,19.99 19.28,22.94
RINPUT1
  Top 0.203: J5.13 18.21,37.67 14.24,37.67 12.38,35.81 12.38,32.14 11.75,31.5 R7.1
RINPUT2
  Top 0.203: J5.14 21.59,36.83 20.95,36.83 19.2,38.58 13.18,38.58 10.79,36.2 10.79,32.01 10.16,31.37 R8.1
RINPUT3
  Top 0.203: J5.15 22.97,36.83 20.35,39.45 12.38,39.45 9.21,36.27 9.21,32.01 8.57,31.37 R9.1
SCL  (via drill 0.38)
  Top 0.203: U4.17 10.95,19.31 7.32,15.67 v6.96,15.67 6.66,15.67 5.79,16.54 5.79,16.92 2.52,20.19 2.52,22.89 J4.10 | J1.4 14.2,4.07 13.28,3.15 8.91,3.15 v7.95,4.12 v7.94,4.12 7.73,3.9 R2.1 | v6.03,13.65 v6.03,10.16
  Bottom 0.203: v6.96,15.67 6.03,14.74 v6.03,13.65 | v7.94,4.12 6.03,6.02 v6.03,10.16
SDA  (via drill 0.38)
  Top 0.203: U4.18 11.45,19.22 6.99,14.76 6.99,14.73 | J4.9 2.07,20.79 2.07,20.05 5.23,16.89 5.23,16.48 6.99,14.73 | J1.3 13.2,4.03 12.85,3.68 9.32,3.68 v7.94,5.07 7.77,4.9 R3.1 | v6.99,10.3 6.99,14.73
  Bottom 0.203: v7.94,5.07 6.99,6.01 v6.99,10.3
SPK_LN
  Top 0.508: J5.3 22.8,6.35 17.15,12.01 C15.1 17.15,14.16 16.62,14.68 L1.2
SPK_LP
  Top 0.508: J5.4 21.52,8.89 18.46,11.95 C16.1 18.46,13.92 18.29,14.08 L2.2
SPK_RN
  Top 0.508: L4.2 11.27,14.55 11.02,14.29 C18.1 11.02,12.48 12.44,11.06 14.34,11.06 J5.1
SPK_RP
  Top 0.508: J5.2 22.89,3.81 14.67,12.02 C17.1 14.67,14.28 14.95,14.55 L3.2
SPKVDD  (via drill 0.38)
  Top 0.203: U4.21 12.95,19.12 13.1,18.98 13.1,18.44 13.09,18.43 C6.1 13.41,17 v14.2,16.21 | U4.26 16.12,20.98 16.81,20.29 C7.1 17.62,19.49 v17.62,19.4
  Bottom 0.508: J4.5 SPKVDD.2 12.38,11.43 14.2,13.25 v14.2,16.21 14.2,16.45 17.14,19.4 v17.62,19.4
VIN  (via drill 0.38)
  Top 0.203: 3.94,8.89 3.94,7.49 4.59,6.84 R18.1
  Top 0.508: v8.26,9.84 8.24,9.84 7.91,9.51 U3.1 C31.1 6.66,8.87 C1.1 5.73,8.89 3.94,8.89 J4.4
  Bottom 0.508: SPKVDD.3 8.55,10.39 8.26,10.1 v8.26,9.84

### Text on the board
Top: 1
Route2: 2
Route15: 3
Bottom: 4 | v10
Measures: UNIT IN INCHES
tDocu: Board thickness is 1.6mm / 4-Layer / 1oz copper outer / 0.5oz copper inner | Pete Lewis | Based on the Top pHAT by Andy England